# EAGLE schematic SOT223 Breakout Board (EAGLE 8.3.2)
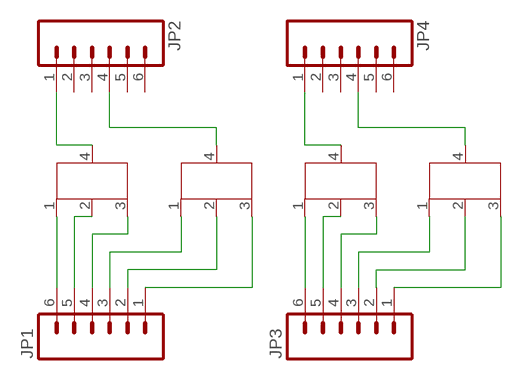
[diagram p0: schematic, sheet 1]

## Parts
JP1  M06  [1X06]
JP2  M06  [1X06]
JP3  M06  [1X06]
JP4  M06  [1X06]
U$1  SOT223  [SOT223]
U$2  SOT223  [SOT223]
U$3  SOT223  [SOT223]
U$4  SOT223  [SOT223]

## Nets
N$1: JP2.1 U$1.4
N$2: JP1.6 U$1.1
N$3: JP1.5 U$1.2
N$4: JP1.4 U$1.3
N$5: JP1.3 U$3.1
N$6: JP1.2 U$3.2
N$7: JP1.1 U$3.3
N$8: JP2.4 U$3.4
N$9: JP4.1 U$2.4
N$10: JP4.4 U$4.4
N$11: JP3.6 U$2.1
N$12: JP3.5 U$2.2
N$13: JP3.4 U$2.3
N$14: JP3.3 U$4.1
N$15: JP3.2 U$4.2
N$16: JP3.1 U$4.3
Unconnected: JP2.2 JP2.3 JP2.5 JP2.6 JP4.2 JP4.3 JP4.5 JP4.6

## Library data of the parts
JP1-JP4 = HyTechDevices:M06: Standard 6-pin 0.1" header. NOTES ON THE VARIANTS LOCK and LOCK_LONGPADS... This footprint was designed to help hold the alignment of a through-hole component (i.e. 6-pin header) while soldering it into place. You may notice that each hole has been shifted either up or down by 0.005 of an inch from it's more standard position (which is a perfectly straight line). This slight alteration caused the pins (the squares in the middle) to touch the edges of the holes. Because they are alternating, it causes a "brace" to hold the component in place. 0.005 has proven to be the perfect amount of "off-center" position when using our standard breakaway headers. Although looks a little odd when you look at the bare footprint, once you have a header in there, the alteration is very hard to notice. Also,if you push a header all the way into place, it is covered up entirely on the bottom side. This idea of altering the position of holes to aid alignment will be further integrated into the Sparkfun Library for other footprints. It can help hold any component with 3 or more connection pins. Note: The Sparkfun version includes many other packages including surface mount that may be of future interest. Source: Sparkfun <https://github.com/sparkfun/SparkFun-Eagle-Libraries>
U$1-U$4 = HyTechDevices:SOT223